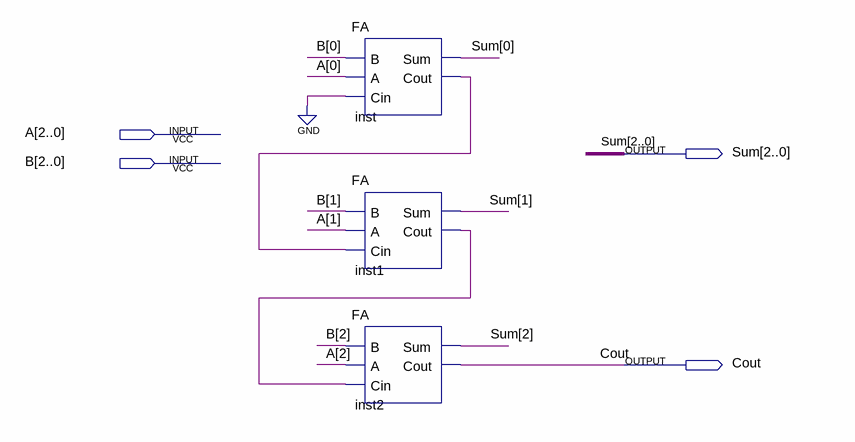
[diagram p0: schematic sheet]
// Quartus schematic adder_3_bit.bdf as structural Verilog: 3 symbols, 4 pins
module adder_3_bit (
  input  [2:0] A,
  input  [2:0] B,
  output [2:0] Sum,
  output Cout
);

  wire inst1_cout, inst_cout;

  FA inst (.B(B[0]), .A(A[0]), .Cin(1'b0), .Sum(Sum[0]), .Cout(inst_cout));
  FA inst1 (.B(B[1]), .A(A[1]), .Cin(inst_cout), .Sum(Sum[1]), .Cout(inst1_cout));
  FA inst2 (.B(B[2]), .A(A[2]), .Cin(inst1_cout), .Sum(Sum[2]), .Cout(Cout));
endmodule
